# Altium schematic sheet Sheet1.SchDoc: =T1
size B; SheetNumber: 1; EngineerDate: XX/XX/XX; MFGDate: XX/XX/XX; ReleaseDate: Day of Week, Month XX, XXXX; BECO: ----; EECO: ----; FECO: ----; GECO: ----; HECO: ----; IECO: ----
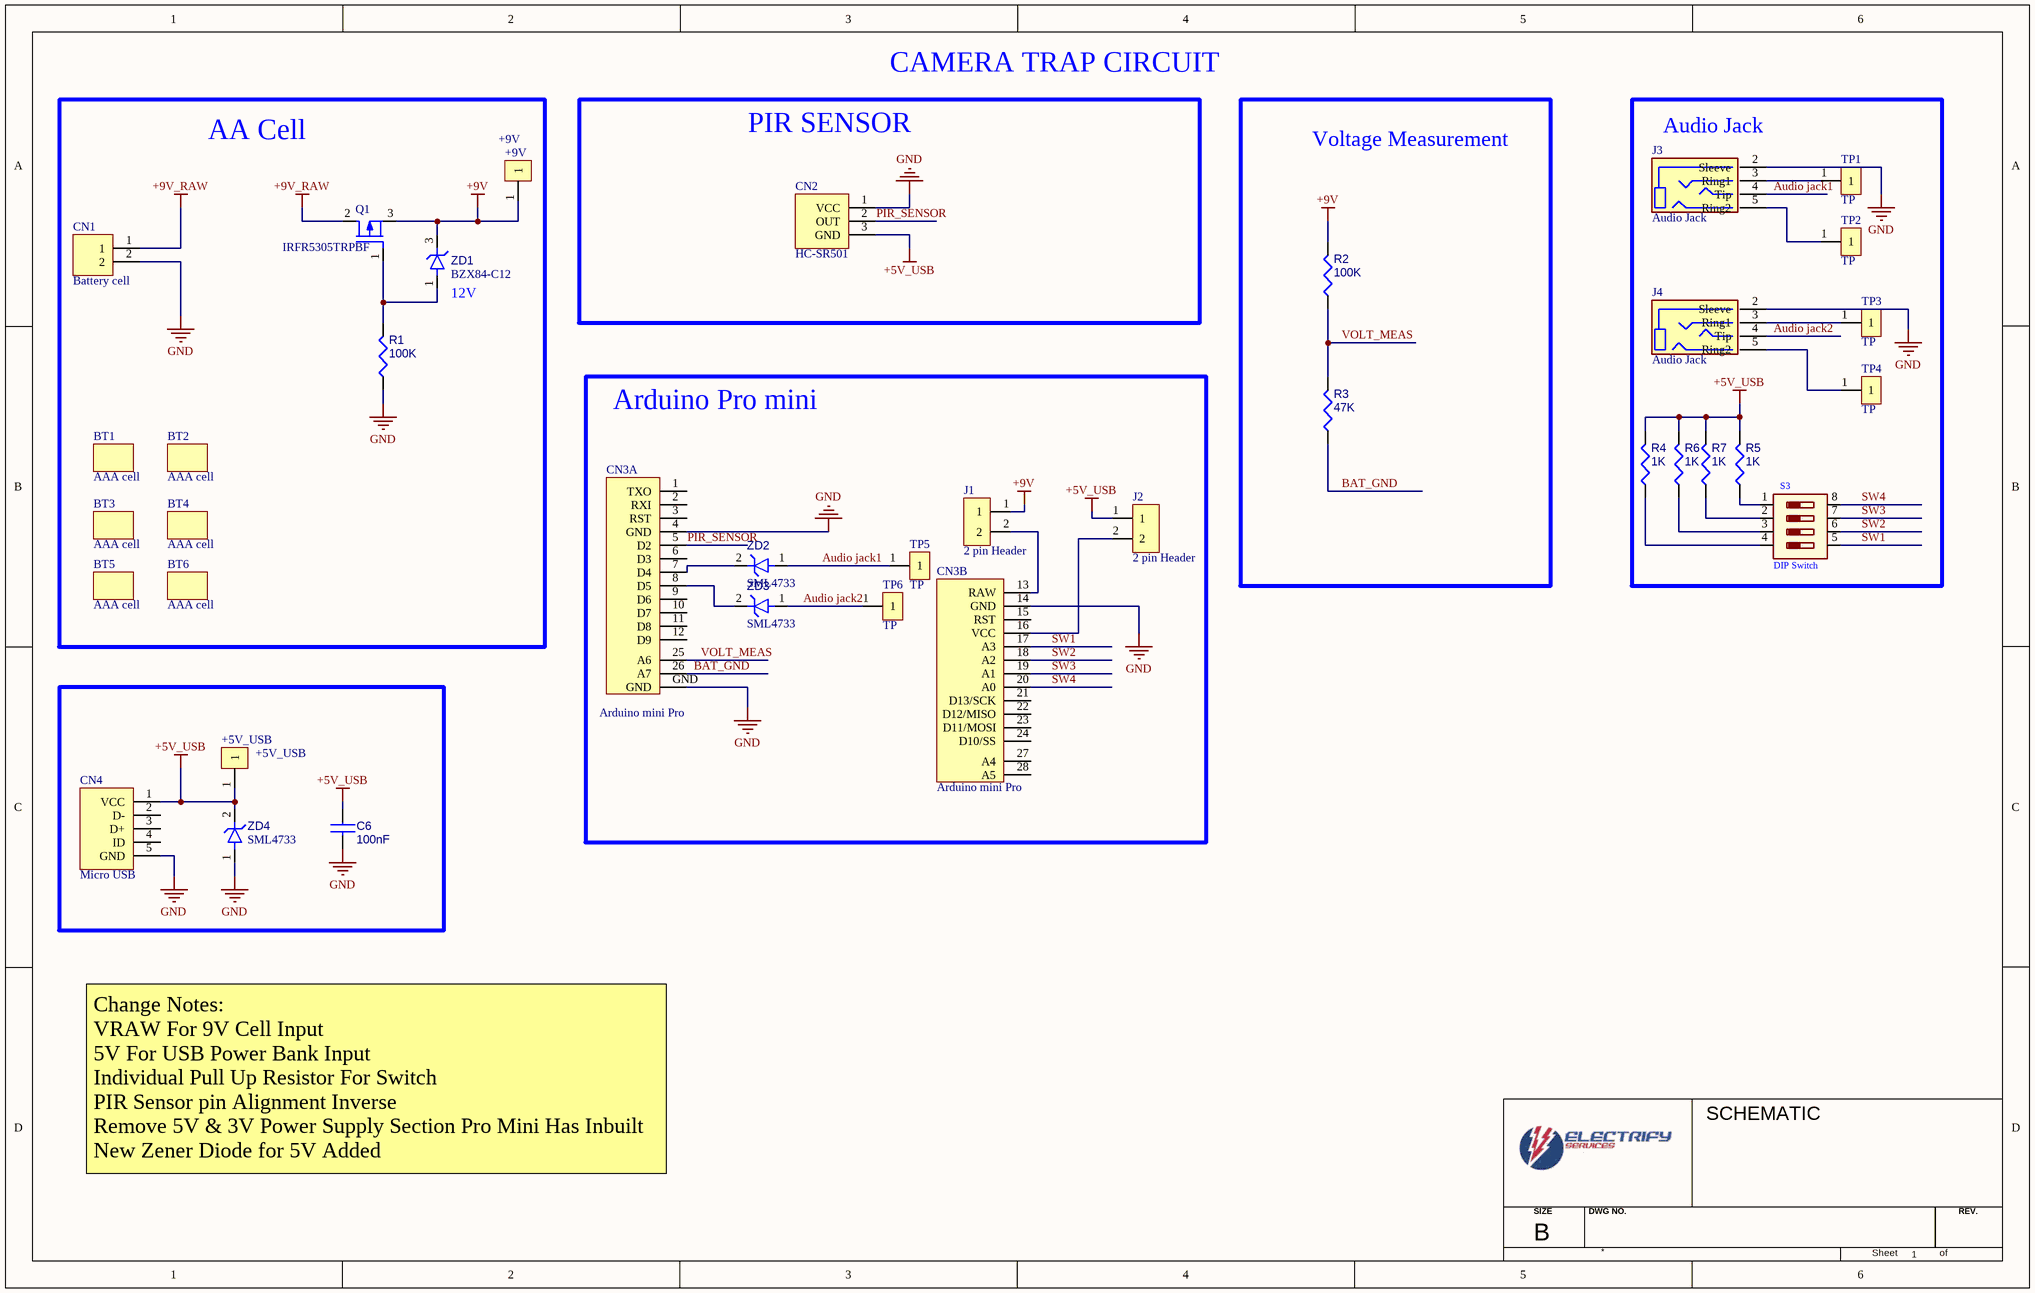
[diagram p0: Sheet1.SchDoc]

## Parts
+5V_USB  +5V_USB  [TP_SMD]
+9V  +9V  [TP_SMD]
BT1  AAA cell  (mechanical)
BT2  AAA cell  (mechanical)
BT3  AAA cell  (mechanical)
BT4  AAA cell  (mechanical)
BT5  AAA cell  (mechanical)
BT6  AAA cell  (mechanical)
C6  100nF  [CAP_0603_MANUAL]
CN1  Battery cell  [BAT_AAA]
CN2  HC-SR501  [PIR-SR501]
CN3  Arduino mini Pro  [Arduino pro mini]  (parts A,B of 2)
CN4  Micro USB  [AMPHENOL_10118194-0001LF]
J1  2 pin Header  [2Pin_Header_2.54mmpitch]
J2  2 pin Header  [2Pin_Header_2.54mmpitch]
J3  Audio Jack  [Audio JAck]
J4  Audio Jack  [Audio JAck]
Q1  IRFR5305TRPBF  [TO-252]
R1  100K  [RES_0603_MANUAL]
R2  100K  [RES_0603_MANUAL]
R3  47K  [RES_0603_MANUAL]
R4  1K  [RES_0603_MANUAL]
R5  1K  [RES_0603_MANUAL]
R6  1K  [RES_0603_MANUAL]
R7  1K  [RES_0603_MANUAL]
S3  DIP Switch  [DIP Switch]
TP1  TP  [Tp]
TP2  TP  [Tp]
TP3  TP  [Tp]
TP4  TP  [Tp]
TP5  TP  [Tp]
TP6  TP  [Tp]
ZD1  BZX84-C12  [SOT-23]
ZD2  SML4733  [DO-214AC_SMA]
ZD3  SML4733  [DO-214AC_SMA]
ZD4  SML4733  [DO-214AC_SMA]

## Blocks framed on the sheet
AA Cell: +9V BT1-BT6 CN1 Q1 R1 ZD1
PIR SENSOR: CN2
Voltage Measurement: R2 R3
Audio Jack: J3 J4 R4-R7 S3 TP1-TP4
Arduino Pro mini: CN3 J1 J2 TP5 TP6 ZD2 ZD3

## Nets
+5V_USB: +5V_USB.1 C6.1 CN2.3(GND) CN4.1(VCC) J2.1 R4.2 R5.2 R6.2 R7.2 ZD4.2(C)
+9V: +9V.1 J1.1 Q1.3(SOURCE) R2.2 ZD1.3(C)
+9V_RAW: CN1.1 Q1.2(DRAIN)
GND: C6.2 CN1.2 CN2.1(VCC) CN3.4(GND) CN3.14(GND) CN3.GND CN4.5(GND) J3.2(Sleeve) J4.2(Sleeve) R1.1 ZD4.1(A)
Audio jack1: J3.4(Tip) TP5.1 ZD2.1(A)
Audio jack2: J4.4(Tip) TP6.1 ZD3.1(A)
BAT_GND: CN3.26(A7) R3.1
PIR_SENSOR: CN2.2(OUT) CN3.5(D2)
SW1: CN3.17(A3) S3.5
SW2: CN3.18(A2) S3.6
SW3: CN3.19(A1) S3.7
SW4: CN3.20(A0) S3.8
VOLT_MEAS: CN3.25(A6) R2.1 R3.2
NetCN3_7: CN3.7(D4) ZD2.2(C)
NetCN3_8: CN3.8(D5) ZD3.2(C)
NetCN3_13: CN3.13(RAW) J1.2
NetCN3_16: CN3.16(VCC) J2.2
NetJ3_3: J3.3(Ring1) TP1.1
NetJ3_5: J3.5(Ring2) TP2.1
NetJ4_3: J4.3(Ring1) TP3.1
NetJ4_5: J4.5(Ring2) TP4.1
NetQ1_1: Q1.1(GATE) R1.2 ZD1.1(A)
NetR4_1: R4.1 S3.4
NetR5_1: R5.1 S3.1
NetR6_1: R6.1 S3.3
NetR7_1: R7.1 S3.2

Not connected (* = marked no-connect by the designer): CN3 1(TXO) 2(RXI) 3(RST) 6(D3) 9(D6) 10(D7) 11(D8) 12(D9) 15(RST) 21(D13/SCK) 22(D12/MISO) 23(D11/MOSI) 24(D10/SS) 27(A4) 28(A5); CN4 2(D-) 3(D+) 4(ID)

## Notes on the sheet
- CAMERA TRAP CIRCUIT
- (near ZD1) 12V
- Change Notes:
  VRAW For 9V Cell Input
  5V For USB Power Bank Input
  Individual Pull Up Resistor For Switch
  PIR Sensor pin Alignment Inverse
  Remove 5V & 3V Power Supply Section Pro Mini Has Inbuilt
  New Zener Diode for 5V Added
- SCHEMATIC
- SIZE
- B
- DWG NO.
- REV.
- Sheet
- of

## Library data of the parts
+5V_USB +9V = TP
BT1-BT6 = Battery Holder
C6 = CAP CER 100nF 50V X7R 0603: 100nF 104 0603 (1608 metric) 50V X7R MLCC; Sunrom P/N: 5190; Value: 100nF; Manufacturer1: *; Manufacturer1_P/N: *
CN1 = Battery Cell: 6x AAA cell; Robu P/N: 294162
CN2 = PIR Motion Detection Sensor HC-SR501: Sunrom P/N: 4176
CN3 = Arduino mini Pro: Pro Mini - ATMEGA 328P - 5V 16Mhz - Compatible Board; EC_P/N: 0923
CN4 = Micro USB Connector: MicroUSB Connector with through hole; Sunrom P/N: 4653
J1 J2 = 2 pin Header: Sunrom P/N: 7197
J3 J4 = Stereo Socket 3.5mm PCB Mount SMD: Sunrom P/N: 5543
Q1 = MOSFET P-CH 55V 31A TO252: IRFR5305TRPBF (31A 55V) IRFR5305 TO252 P-CH MOSFET; Manufacturer: Infineon Technologies; Sunrom P/N: 6680; Manufacturer_P/N: IRFR5305TRPBF
R1 = RES 100K OHM 1% 0603: 47K 1% 0603; Sunrom P/N: 5108; Value: 100K
R2 = 100K 1% 0603: Sunrom P/N: 5108; Value: 100K
R3 = RES 47K OHM 1% 0603: 47K 1% 0603; Sunrom P/N: 6636; Value: 47K
R4-R7 = 1K 1% 0603: 100K 1% 0603; Sunrom P/N: 5191; Value: 1K
S3 = SPST DIP Switch: 4 Way 2.54MM DIP switch; Sunrom P/N: 5841
ZD1 = BZX84-C12 NXP 12V 250mW SOT23: BZX84-C12 NXP 12V 250mW SOT23 Zener Diode; Sunrom P/N: 5396
ZD2-ZD4 = SML4733 5.1V 1W Zener Diode DO-214AC: SML4733 5.1V 1W Zener Diode DO-214AC (SMA) SMD; Sunrom P/N: 5396